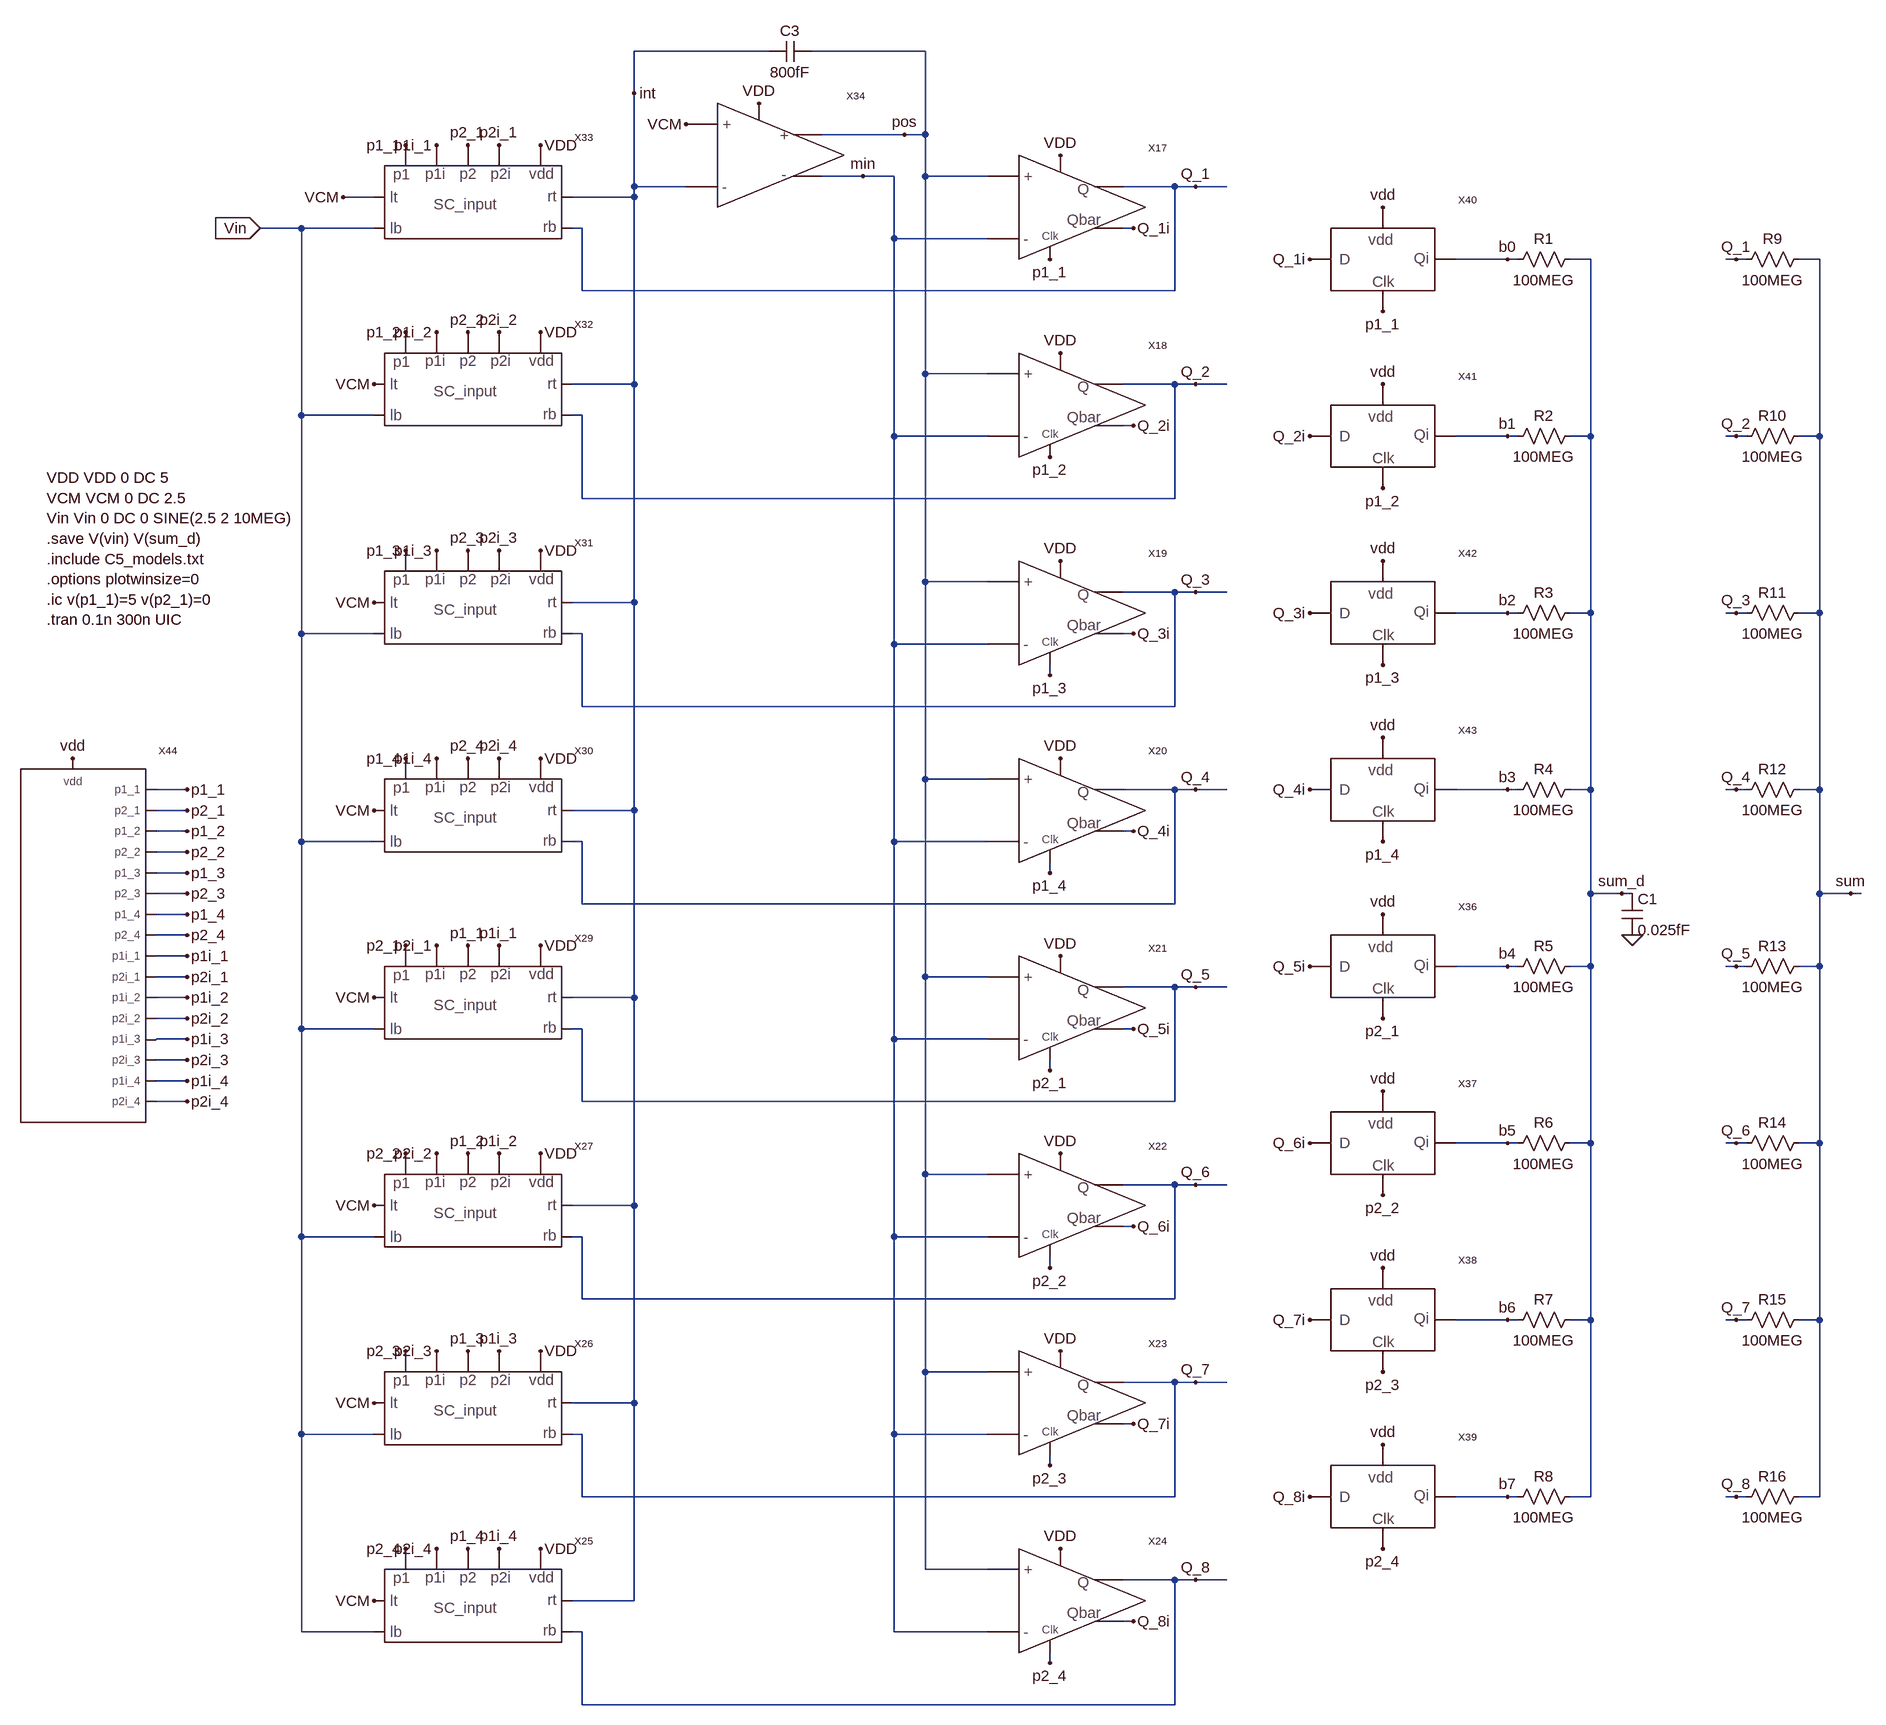
[diagram p0: schematic _Fig9_33_MSD.asc]
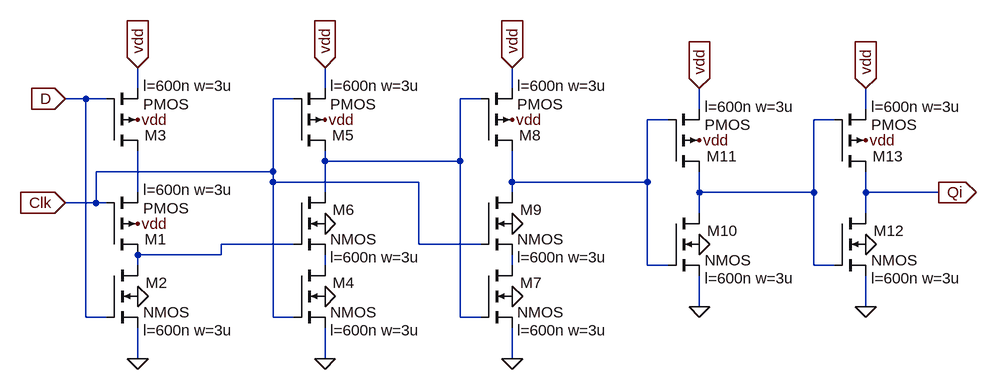
[diagram p1: sub-circuit dflop.asc]
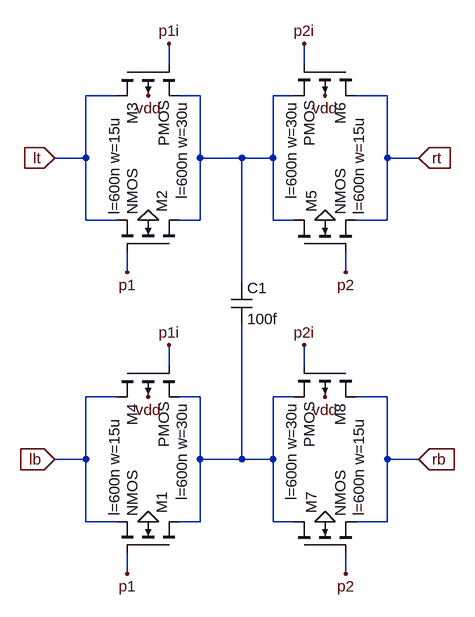
[diagram p2: sub-circuit sc_input.asc]
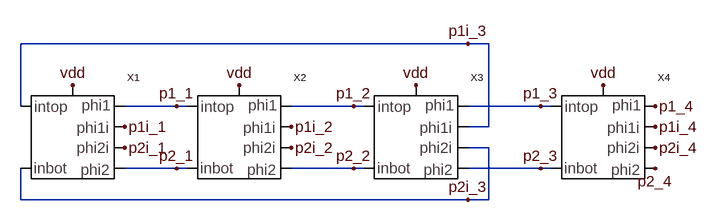
[diagram p3: sub-circuit clock_gen.asc]
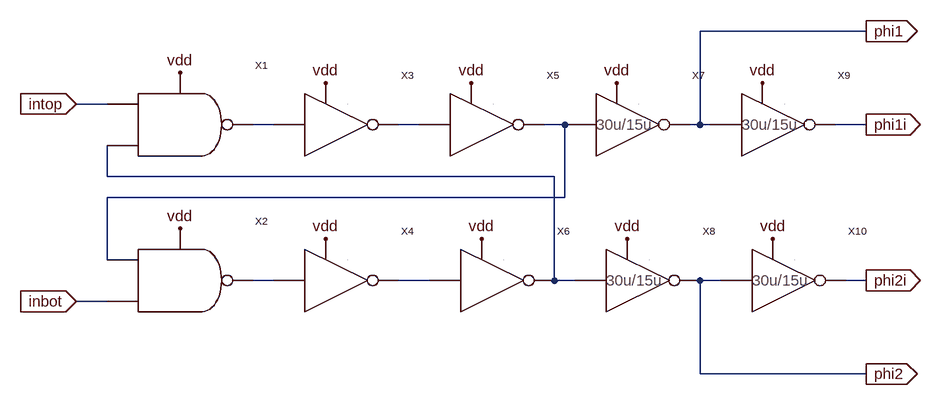
[diagram p4: sub-circuit delay.asc]
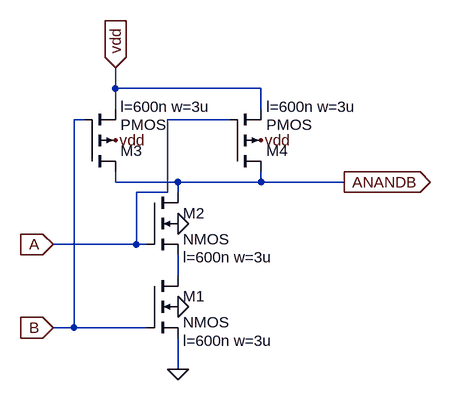
[diagram p5: sub-circuit nand_2.asc]
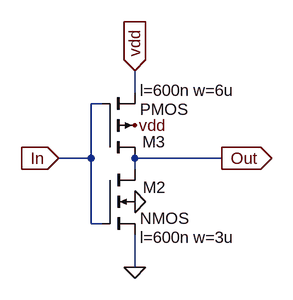
[diagram p6: sub-circuit inv_6u_3u.asc]
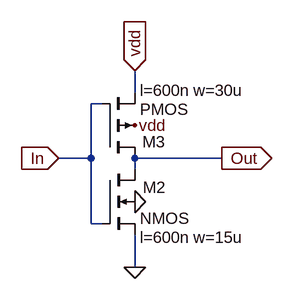
[diagram p7: sub-circuit inv_30u_15u.asc]
_Fig9_33_MSD.asc, the LTspice schematic file:
Version 4
SHEET 1 4792 3092
WIRE 1792 320 1584 320
WIRE 2032 320 1856 320
WIRE 1584 384 1584 320
WIRE 2000 448 1872 448
WIRE 2032 448 2032 320
WIRE 2032 448 2000 448
WIRE 1936 512 1872 512
WIRE 1984 512 1936 512
WIRE 2032 512 2032 448
WIRE 2128 512 2032 512
WIRE 1584 528 1584 384
WIRE 1664 528 1584 528
WIRE 2416 528 2336 528
WIRE 2448 528 2416 528
WIRE 2496 528 2448 528
WIRE 1184 544 1136 544
WIRE 1584 544 1584 528
WIRE 1584 544 1488 544
WIRE 1072 592 1008 592
WIRE 1184 592 1072 592
WIRE 1504 592 1488 592
WIRE 2352 592 2336 592
WIRE 1984 608 1984 512
WIRE 2128 608 1984 608
WIRE 2928 640 2848 640
WIRE 2944 640 2928 640
WIRE 3056 640 3024 640
WIRE 3280 640 3264 640
WIRE 3296 640 3280 640
WIRE 3408 640 3376 640
WIRE 1504 688 1504 592
WIRE 2416 688 2416 528
WIRE 2416 688 1504 688
WIRE 2032 816 2032 512
WIRE 2128 816 2032 816
WIRE 1584 832 1584 544
WIRE 1584 832 1488 832
WIRE 2416 832 2336 832
WIRE 2448 832 2416 832
WIRE 2496 832 2448 832
WIRE 1072 880 1072 592
WIRE 1184 880 1072 880
WIRE 1504 880 1488 880
WIRE 2352 896 2336 896
WIRE 1984 912 1984 608
WIRE 2128 912 1984 912
WIRE 2928 912 2848 912
WIRE 2944 912 2928 912
WIRE 3056 912 3056 640
WIRE 3056 912 3024 912
WIRE 3280 912 3264 912
WIRE 3296 912 3280 912
WIRE 3408 912 3408 640
WIRE 3408 912 3376 912
WIRE 1504 1008 1504 880
WIRE 2416 1008 2416 832
WIRE 2416 1008 1504 1008
WIRE 2032 1136 2032 816
WIRE 2128 1136 2032 1136
WIRE 2416 1152 2336 1152
WIRE 2448 1152 2416 1152
WIRE 2496 1152 2448 1152
WIRE 1584 1168 1584 832
WIRE 1584 1168 1488 1168
WIRE 2928 1184 2848 1184
WIRE 2944 1184 2928 1184
WIRE 3056 1184 3056 912
WIRE 3056 1184 3024 1184
WIRE 3280 1184 3264 1184
WIRE 3296 1184 3280 1184
WIRE 3408 1184 3408 912
WIRE 3408 1184 3376 1184
WIRE 1072 1216 1072 880
WIRE 1184 1216 1072 1216
WIRE 1504 1216 1488 1216
WIRE 2352 1216 2336 1216
WIRE 1984 1232 1984 912
WIRE 2128 1232 1984 1232
WIRE 2224 1280 2224 1264
WIRE 1504 1328 1504 1216
WIRE 2416 1328 2416 1152
WIRE 2416 1328 1504 1328
WIRE 2032 1440 2032 1136
WIRE 2128 1440 2032 1440
WIRE 896 1456 848 1456
WIRE 2416 1456 2336 1456
WIRE 2448 1456 2416 1456
WIRE 2496 1456 2448 1456
WIRE 2928 1456 2848 1456
WIRE 2944 1456 2928 1456
WIRE 3056 1456 3056 1184
WIRE 3056 1456 3024 1456
WIRE 3280 1456 3264 1456
WIRE 3296 1456 3280 1456
WIRE 3408 1456 3408 1184
WIRE 3408 1456 3376 1456
WIRE 896 1488 848 1488
WIRE 1584 1488 1584 1168
WIRE 1584 1488 1488 1488
WIRE 896 1520 848 1520
WIRE 2352 1520 2336 1520
WIRE 1072 1536 1072 1216
WIRE 1184 1536 1072 1536
WIRE 1504 1536 1488 1536
WIRE 1984 1536 1984 1232
WIRE 2128 1536 1984 1536
WIRE 896 1552 848 1552
WIRE 896 1584 848 1584
WIRE 2224 1584 2224 1568
WIRE 896 1616 848 1616
WIRE 3056 1616 3056 1456
WIRE 3104 1616 3056 1616
WIRE 3120 1616 3104 1616
WIRE 3408 1616 3408 1456
WIRE 3456 1616 3408 1616
WIRE 3472 1616 3456 1616
WIRE 1504 1632 1504 1536
WIRE 2416 1632 2416 1456
WIRE 2416 1632 1504 1632
WIRE 896 1648 848 1648
WIRE 896 1680 848 1680
WIRE 896 1712 848 1712
WIRE 2928 1728 2848 1728
WIRE 2944 1728 2928 1728
WIRE 3056 1728 3056 1616
WIRE 3056 1728 3024 1728
WIRE 3280 1728 3264 1728
WIRE 3296 1728 3280 1728
WIRE 3408 1728 3408 1616
WIRE 3408 1728 3376 1728
WIRE 896 1744 848 1744
WIRE 2032 1744 2032 1440
WIRE 2128 1744 2032 1744
WIRE 2416 1760 2336 1760
WIRE 2448 1760 2416 1760
WIRE 2496 1760 2448 1760
WIRE 896 1776 848 1776
WIRE 1584 1776 1584 1488
WIRE 1584 1776 1488 1776
WIRE 896 1808 848 1808
WIRE 1072 1824 1072 1536
WIRE 1184 1824 1072 1824
WIRE 1504 1824 1488 1824
WIRE 2352 1824 2336 1824
WIRE 896 1840 848 1840
WIRE 1984 1840 1984 1536
WIRE 2128 1840 1984 1840
WIRE 896 1872 848 1872
WIRE 2224 1888 2224 1872
WIRE 896 1904 848 1904
WIRE 896 1936 848 1936
WIRE 1504 1936 1504 1824
WIRE 2416 1936 2416 1760
WIRE 2416 1936 1504 1936
WIRE 2928 2000 2848 2000
WIRE 2944 2000 2928 2000
WIRE 3056 2000 3056 1728
WIRE 3056 2000 3024 2000
WIRE 3280 2000 3264 2000
WIRE 3296 2000 3280 2000
WIRE 3408 2000 3408 1728
WIRE 3408 2000 3376 2000
WIRE 2032 2048 2032 1744
WIRE 2128 2048 2032 2048
WIRE 2416 2064 2336 2064
WIRE 2448 2064 2416 2064
WIRE 2496 2064 2448 2064
WIRE 1584 2096 1584 1776
WIRE 1584 2096 1488 2096
WIRE 2352 2128 2336 2128
WIRE 1072 2144 1072 1824
WIRE 1184 2144 1072 2144
WIRE 1504 2144 1488 2144
WIRE 1984 2144 1984 1840
WIRE 2128 2144 1984 2144
WIRE 2224 2192 2224 2176
WIRE 1504 2240 1504 2144
WIRE 2416 2240 2416 2064
WIRE 2416 2240 1504 2240
WIRE 2928 2272 2848 2272
WIRE 2944 2272 2928 2272
WIRE 3056 2272 3056 2000
WIRE 3056 2272 3024 2272
WIRE 3280 2272 3264 2272
WIRE 3296 2272 3280 2272
WIRE 3408 2272 3408 2000
WIRE 3408 2272 3376 2272
WIRE 2032 2352 2032 2048
WIRE 2128 2352 2032 2352
WIRE 2416 2368 2336 2368
WIRE 2448 2368 2416 2368
WIRE 2496 2368 2448 2368
WIRE 1584 2400 1584 2096
WIRE 1584 2400 1488 2400
WIRE 2352 2432 2336 2432
WIRE 1072 2448 1072 2144
WIRE 1184 2448 1072 2448
WIRE 1504 2448 1488 2448
WIRE 1984 2448 1984 2144
WIRE 2128 2448 1984 2448
WIRE 2224 2496 2224 2480
WIRE 1504 2544 1504 2448
WIRE 2416 2544 2416 2368
WIRE 2416 2544 1504 2544
WIRE 2928 2544 2848 2544
WIRE 2944 2544 2928 2544
WIRE 3056 2544 3056 2272
WIRE 3056 2544 3024 2544
WIRE 3280 2544 3264 2544
WIRE 3296 2544 3280 2544
WIRE 3408 2544 3408 2272
WIRE 3408 2544 3376 2544
WIRE 2032 2656 2032 2352
WIRE 2128 2656 2032 2656
WIRE 2416 2672 2336 2672
WIRE 2448 2672 2416 2672
WIRE 2496 2672 2448 2672
WIRE 1584 2704 1584 2400
WIRE 1584 2704 1488 2704
WIRE 2352 2736 2336 2736
WIRE 1072 2752 1072 2448
WIRE 1184 2752 1072 2752
WIRE 1504 2752 1488 2752
WIRE 1984 2752 1984 2448
WIRE 2128 2752 1984 2752
WIRE 2224 2800 2224 2784
WIRE 1504 2864 1504 2752
WIRE 2416 2864 2416 2672
WIRE 2416 2864 1504 2864
FLAG 1440 464 VDD
FLAG 1136 544 VCM
FLAG 2240 480 VDD
FLAG 2448 528 Q_1
FLAG 1440 752 VDD
FLAG 1184 832 VCM
FLAG 2240 784 VDD
FLAG 2448 832 Q_2
FLAG 1440 1088 VDD
FLAG 1184 1168 VCM
FLAG 2240 1104 VDD
FLAG 2448 1152 Q_3
FLAG 1440 1408 VDD
FLAG 1184 1488 VCM
FLAG 2240 1408 VDD
FLAG 1440 1696 VDD
FLAG 1184 1776 VCM
FLAG 2240 1712 VDD
FLAG 2448 1760 Q_5
FLAG 1440 2016 VDD
FLAG 1184 2096 VCM
FLAG 2240 2016 VDD
FLAG 2448 2064 Q_6
FLAG 1440 2320 VDD
FLAG 1184 2400 VCM
FLAG 2240 2320 VDD
FLAG 2448 2368 Q_7
FLAG 1440 2624 VDD
FLAG 1184 2704 VCM
FLAG 2240 2624 VDD
FLAG 2448 2672 Q_8
FLAG 2448 1456 Q_4
FLAG 1664 432 VCM
FLAG 2000 448 pos
FLAG 1584 384 int
FLAG 2224 640 p1_1
FLAG 2224 944 p1_2
FLAG 2224 1280 p1_3
FLAG 2224 1584 p1_4
FLAG 2224 1888 p2_1
FLAG 2224 2192 p2_2
FLAG 2224 2496 p2_3
FLAG 2224 2800 p2_4
FLAG 1232 464 p1_1
FLAG 1328 464 p2_1
FLAG 1232 752 p1_2
FLAG 1328 752 p2_2
FLAG 1232 1088 p1_3
FLAG 1328 1088 p2_3
FLAG 1232 1408 p1_4
FLAG 1328 1408 p2_4
FLAG 1232 1696 p2_1
FLAG 1328 1696 p1_1
FLAG 1232 2016 p2_2
FLAG 1328 2016 p1_2
FLAG 1232 2320 p2_3
FLAG 1328 2320 p1_3
FLAG 1232 2624 p2_4
FLAG 1328 2624 p1_4
FLAG 2928 640 b0
FLAG 2928 912 b1
FLAG 2928 1184 b2
FLAG 2928 1456 b3
FLAG 2928 1728 b4
FLAG 2928 2000 b5
FLAG 2928 2272 b6
FLAG 2928 2544 b7
FLAG 2624 1728 Q_5i
FLAG 2624 2000 Q_6i
FLAG 2624 2272 Q_7i
FLAG 2624 2544 Q_8i
FLAG 2624 640 Q_1i
FLAG 2624 912 Q_2i
FLAG 2624 1184 Q_3i
FLAG 2624 1456 Q_4i
FLAG 2736 1648 vdd
FLAG 2736 1920 vdd
FLAG 2736 2192 vdd
FLAG 2736 2464 vdd
FLAG 2736 560 vdd
FLAG 2736 832 vdd
FLAG 2736 1104 vdd
FLAG 2736 1376 vdd
FLAG 2736 2624 p2_4
FLAG 2736 2352 p2_3
FLAG 2736 2080 p2_2
FLAG 2736 1808 p2_1
FLAG 2736 1536 p1_4
FLAG 2736 1264 p1_3
FLAG 2736 992 p1_2
FLAG 2736 720 p1_1
FLAG 720 1408 vdd
FLAG 896 1456 p1_1
FLAG 896 1488 p2_1
FLAG 896 1520 p1_2
FLAG 896 1552 p2_2
FLAG 896 1584 p1_3
FLAG 896 1616 p2_3
FLAG 896 1648 p1_4
FLAG 896 1680 p2_4
FLAG 896 1712 p1i_1
FLAG 896 1744 p2i_1
FLAG 896 1776 p1i_2
FLAG 896 1808 p2i_2
FLAG 896 1840 p1i_3
FLAG 896 1872 p2i_3
FLAG 896 1904 p1i_4
FLAG 896 1936 p2i_4
FLAG 1936 512 min
FLAG 2352 592 Q_1i
FLAG 2352 896 Q_2i
FLAG 2352 1216 Q_3i
FLAG 1776 400 VDD
FLAG 1280 464 p1i_1
FLAG 1376 464 p2i_1
FLAG 1280 752 p1i_2
FLAG 1376 752 p2i_2
FLAG 1280 1088 p1i_3
FLAG 1376 1088 p2i_3
FLAG 1280 1408 p1i_4
FLAG 1376 1408 p2i_4
FLAG 1280 1696 p2i_1
FLAG 1376 1696 p1i_1
FLAG 1280 2016 p2i_2
FLAG 1376 2016 p1i_2
FLAG 1280 2320 p2i_3
FLAG 1376 2320 p1i_3
FLAG 1280 2624 p2i_4
FLAG 1376 2624 p1i_4
FLAG 2352 1520 Q_4i
FLAG 2352 1824 Q_5i
FLAG 2352 2128 Q_6i
FLAG 2352 2432 Q_7i
FLAG 2352 2736 Q_8i
FLAG 1008 592 Vin
IOPIN 1008 592 In
FLAG 3120 1680 0
FLAG 3104 1616 sum_d
FLAG 3280 640 Q_1
FLAG 3280 912 Q_2
FLAG 3280 1184 Q_3
FLAG 3280 1456 Q_4
FLAG 3280 1728 Q_5
FLAG 3280 2000 Q_6
FLAG 3280 2272 Q_7
FLAG 3280 2544 Q_8
FLAG 3456 1616 sum
SYMBOL cap 1792 336 R270
WINDOW 0 32 32 VTop 2
WINDOW 3 0 32 VBottom 2
SYMATTR InstName C3
SYMATTR Value 800fF
SYMBOL dflop 2656 1776 R0
SYMATTR InstName X36
SYMBOL dflop 2656 2048 R0
SYMATTR InstName X37
SYMBOL dflop 2656 2320 R0
SYMATTR InstName X38
SYMBOL dflop 2656 2592 R0
SYMATTR InstName X39
SYMBOL dflop 2656 688 R0
SYMATTR InstName X40
SYMBOL dflop 2656 960 R0
SYMATTR InstName X41
SYMBOL dflop 2656 1232 R0
SYMATTR InstName X42
SYMBOL dflop 2656 1504 R0
SYMATTR InstName X43
SYMBOL SC_input 1248 2784 R0
SYMATTR InstName X25
SYMBOL SC_input 1248 2480 R0
SYMATTR InstName X26
SYMBOL SC_input 1248 2176 R0
SYMATTR InstName X27
SYMBOL SC_input 1248 1856 R0
SYMATTR InstName X29
SYMBOL SC_input 1248 1568 R0
SYMATTR InstName X30
SYMBOL SC_input 1248 1248 R0
SYMATTR InstName X31
SYMBOL SC_input 1248 912 R0
SYMATTR InstName X32
SYMBOL SC_input 1248 624 R0
SYMATTR InstName X33
SYMBOL clock_gen 768 1584 R0
SYMATTR InstName X44
SYMBOL clk_comparator 2176 560 R0
SYMATTR InstName X17
SYMBOL clk_comparator 2176 864 R0
SYMATTR InstName X18
SYMBOL clk_comparator 2176 1184 R0
SYMATTR InstName X19
SYMBOL clk_comparator 2176 1488 R0
SYMATTR InstName X20
SYMBOL clk_comparator 2176 1792 R0
SYMATTR InstName X21
SYMBOL clk_comparator 2176 2096 R0
SYMATTR InstName X22
SYMBOL clk_comparator 2176 2400 R0
SYMATTR InstName X23
SYMBOL clk_comparator 2176 2704 R0
SYMATTR InstName X24
SYMBOL amp 1712 480 R0
SYMATTR InstName X34
SYMBOL res 3040 624 R90
WINDOW 0 0 56 VBottom 2
WINDOW 3 32 56 VTop 2
SYMATTR InstName R1
SYMATTR Value 100MEG
SYMBOL res 3040 896 R90
WINDOW 0 0 56 VBottom 2
WINDOW 3 32 56 VTop 2
SYMATTR InstName R2
SYMATTR Value 100MEG
SYMBOL res 3040 1168 R90
WINDOW 0 0 56 VBottom 2
WINDOW 3 32 56 VTop 2
SYMATTR InstName R3
SYMATTR Value 100MEG
SYMBOL res 3040 1440 R90
WINDOW 0 0 56 VBottom 2
WINDOW 3 32 56 VTop 2
SYMATTR InstName R4
SYMATTR Value 100MEG
SYMBOL res 3040 1712 R90
WINDOW 0 0 56 VBottom 2
WINDOW 3 32 56 VTop 2
SYMATTR InstName R5
SYMATTR Value 100MEG
SYMBOL res 3040 1984 R90
WINDOW 0 0 56 VBottom 2
WINDOW 3 32 56 VTop 2
SYMATTR InstName R6
SYMATTR Value 100MEG
SYMBOL res 3040 2256 R90
WINDOW 0 0 56 VBottom 2
WINDOW 3 32 56 VTop 2
SYMATTR InstName R7
SYMATTR Value 100MEG
SYMBOL res 3040 2528 R90
WINDOW 0 0 56 VBottom 2
WINDOW 3 32 56 VTop 2
SYMATTR InstName R8
SYMATTR Value 100MEG
SYMBOL cap 3104 1616 R0
SYMATTR InstName C1
SYMATTR Value 0.025fF
SYMBOL res 3392 624 R90
WINDOW 0 0 56 VBottom 2
WINDOW 3 32 56 VTop 2
SYMATTR InstName R9
SYMATTR Value 100MEG
SYMBOL res 3392 896 R90
WINDOW 0 0 56 VBottom 2
WINDOW 3 32 56 VTop 2
SYMATTR InstName R10
SYMATTR Value 100MEG
SYMBOL res 3392 1168 R90
WINDOW 0 0 56 VBottom 2
WINDOW 3 32 56 VTop 2
SYMATTR InstName R11
SYMATTR Value 100MEG
SYMBOL res 3392 1440 R90
WINDOW 0 0 56 VBottom 2
WINDOW 3 32 56 VTop 2
SYMATTR InstName R12
SYMATTR Value 100MEG
SYMBOL res 3392 1712 R90
WINDOW 0 0 56 VBottom 2
WINDOW 3 32 56 VTop 2
SYMATTR InstName R13
SYMATTR Value 100MEG
SYMBOL res 3392 1984 R90
WINDOW 0 0 56 VBottom 2
WINDOW 3 32 56 VTop 2
SYMATTR InstName R14
SYMATTR Value 100MEG
SYMBOL res 3392 2256 R90
WINDOW 0 0 56 VBottom 2
WINDOW 3 32 56 VTop 2
SYMATTR InstName R15
SYMATTR Value 100MEG
SYMBOL res 3392 2528 R90
WINDOW 0 0 56 VBottom 2
WINDOW 3 32 56 VTop 2
SYMATTR InstName R16
SYMATTR Value 100MEG
TEXT 680 976 Left 2 !VDD VDD 0 DC 5\nVCM VCM 0 DC 2.5\nVin Vin 0 DC 0 SINE(2.5 2 10MEG)\n.save V(vin) V(sum_d)\n.include C5_models.txt\n.options plotwinsize=0\n.ic v(p1_1)=5 v(p2_1)=0\n.tran 0.1n 300n UIC

dflop.asc, the sub-circuit schematic file:
Version 4
SHEET 1 1692 680
WIRE 272 -208 272 -240
WIRE 560 -208 560 -240
WIRE 848 -208 848 -240
WIRE 192 -192 160 -192
WIRE 224 -192 192 -192
WIRE 512 -192 480 -192
WIRE 800 -192 768 -192
WIRE 1136 -176 1136 -208
WIRE 1392 -176 1392 -208
WIRE 1088 -160 1056 -160
WIRE 1344 -160 1312 -160
WIRE 560 -96 560 -112
WIRE 768 -96 768 -192
WIRE 768 -96 560 -96
WIRE 480 -80 480 -192
WIRE 480 -80 208 -80
WIRE 480 -64 480 -80
WIRE 704 -64 480 -64
WIRE 848 -64 848 -112
WIRE 1056 -64 1056 -160
WIRE 1056 -64 848 -64
WIRE 272 -48 272 -112
WIRE 560 -48 560 -96
WIRE 848 -48 848 -64
WIRE 1136 -48 1136 -80
WIRE 1312 -48 1312 -160
WIRE 1312 -48 1136 -48
WIRE 1392 -48 1392 -80
WIRE 1504 -48 1392 -48
WIRE 208 -32 208 -80
WIRE 208 -32 160 -32
WIRE 224 -32 208 -32
WIRE 1136 -16 1136 -48
WIRE 1392 -16 1392 -48
WIRE 512 32 400 32
WIRE 704 32 704 -64
WIRE 800 32 704 32
WIRE 400 48 400 32
WIRE 400 48 272 48
WIRE 272 64 272 48
WIRE 560 64 560 48
WIRE 848 64 848 48
WIRE 1056 64 1056 -64
WIRE 1088 64 1056 64
WIRE 1312 64 1312 -48
WIRE 1344 64 1312 64
WIRE 1136 128 1136 80
WIRE 1392 128 1392 80
WIRE 192 144 192 -192
WIRE 224 144 192 144
WIRE 480 144 480 -64
WIRE 512 144 480 144
WIRE 768 144 768 -96
WIRE 800 144 768 144
WIRE 272 208 272 160
WIRE 560 208 560 160
WIRE 848 208 848 160
FLAG 272 208 0
FLAG 272 112 0
FLAG 160 -192 D
IOPIN 160 -192 In
FLAG 272 -240 vdd
IOPIN 272 -240 In
FLAG 272 -160 vdd
FLAG 1504 -48 Qi
IOPIN 1504 -48 Out
FLAG 160 -32 Clk
IOPIN 160 -32 In
FLAG 272 0 vdd
FLAG 560 208 0
FLAG 560 112 0
FLAG 560 -240 vdd
IOPIN 560 -240 In
FLAG 560 -160 vdd
FLAG 560 0 0
FLAG 848 208 0
FLAG 848 112 0
FLAG 848 -240 vdd
IOPIN 848 -240 In
FLAG 848 -160 vdd
FLAG 848 0 0
FLAG 1136 128 0
FLAG 1136 32 0
FLAG 1136 -208 vdd
IOPIN 1136 -208 In
FLAG 1136 -128 vdd
FLAG 1392 128 0
FLAG 1392 32 0
FLAG 1392 -208 vdd
IOPIN 1392 -208 In
FLAG 1392 -128 vdd
SYMBOL nmos4 224 64 R0
WINDOW 123 56 100 Left 2
WINDOW 0 60 27 Left 2
SYMATTR Value2 l=600n w=3u
SYMATTR InstName M2
SYMBOL pmos4 224 -112 M180
WINDOW 123 56 100 Left 2
WINDOW 0 59 24 Left 2
SYMATTR Value2 l=600n w=3u
SYMATTR InstName M3
SYMBOL pmos4 224 48 M180
WINDOW 123 56 100 Left 2
WINDOW 0 59 24 Left 2
SYMATTR Value2 l=600n w=3u
SYMATTR InstName M1
SYMBOL nmos4 512 64 R0
WINDOW 123 56 100 Left 2
WINDOW 0 60 27 Left 2
SYMATTR Value2 l=600n w=3u
SYMATTR InstName M4
SYMBOL pmos4 512 -112 M180
WINDOW 123 56 100 Left 2
WINDOW 0 59 24 Left 2
SYMATTR Value2 l=600n w=3u
SYMATTR InstName M5
SYMBOL nmos4 512 -48 R0
WINDOW 123 56 100 Left 2
WINDOW 0 60 27 Left 2
SYMATTR Value2 l=600n w=3u
SYMATTR InstName M6
SYMBOL nmos4 800 64 R0
WINDOW 123 56 100 Left 2
WINDOW 0 60 27 Left 2
SYMATTR Value2 l=600n w=3u
SYMATTR InstName M7
SYMBOL pmos4 800 -112 M180
WINDOW 123 56 100 Left 2
WINDOW 0 59 24 Left 2
SYMATTR Value2 l=600n w=3u
SYMATTR InstName M8
SYMBOL nmos4 800 -48 R0
WINDOW 123 56 100 Left 2
WINDOW 0 60 27 Left 2
SYMATTR Value2 l=600n w=3u
SYMATTR InstName M9
SYMBOL nmos4 1088 -16 R0
WINDOW 123 56 100 Left 2
WINDOW 0 60 27 Left 2
SYMATTR Value2 l=600n w=3u
SYMATTR InstName M10
SYMBOL pmos4 1088 -80 M180
WINDOW 123 56 100 Left 2
WINDOW 0 59 24 Left 2
SYMATTR Value2 l=600n w=3u
SYMATTR InstName M11
SYMBOL nmos4 1344 -16 R0
WINDOW 123 56 100 Left 2
WINDOW 0 60 27 Left 2
SYMATTR Value2 l=600n w=3u
SYMATTR InstName M12
SYMBOL pmos4 1344 -80 M180
WINDOW 123 56 100 Left 2
WINDOW 0 59 24 Left 2
SYMATTR Value2 l=600n w=3u
SYMATTR InstName M13

sc_input.asc, the sub-circuit schematic file:
Version 4
SHEET 1 880 716
WIRE 320 -144 320 -176
WIRE 528 -144 528 -176
WIRE 240 -96 192 -96
WIRE 368 -96 336 -96
WIRE 512 -96 480 -96
WIRE 656 -96 608 -96
WIRE 192 0 192 -96
WIRE 192 0 144 0
WIRE 368 0 368 -96
WIRE 432 0 368 0
WIRE 480 0 480 -96
WIRE 480 0 432 0
WIRE 656 0 656 -96
WIRE 704 0 656 0
WIRE 192 96 192 0
WIRE 240 96 192 96
WIRE 368 96 368 0
WIRE 368 96 336 96
WIRE 480 96 480 0
WIRE 512 96 480 96
WIRE 656 96 656 0
WIRE 656 96 608 96
WIRE 256 176 256 144
WIRE 592 176 592 144
WIRE 432 192 432 0
WIRE 320 320 320 288
WIRE 528 320 528 288
WIRE 240 368 192 368
WIRE 368 368 336 368
WIRE 512 368 480 368
WIRE 656 368 608 368
WIRE 192 464 192 368
WIRE 192 464 144 464
WIRE 368 464 368 368
WIRE 432 464 432 256
WIRE 432 464 368 464
WIRE 480 464 480 368
WIRE 480 464 432 464
WIRE 656 464 656 368
WIRE 704 464 656 464
WIRE 192 560 192 464
WIRE 240 560 192 560
WIRE 368 560 368 464
WIRE 368 560 336 560
WIRE 480 560 480 464
WIRE 512 560 480 560
WIRE 656 560 656 464
WIRE 656 560 608 560
WIRE 256 640 256 608
WIRE 592 640 592 608
FLAG 288 96 0
FLAG 288 -96 vdd
FLAG 144 0 lt
IOPIN 144 0 In
FLAG 320 -176 p1i
FLAG 256 176 p1
FLAG 288 560 0
FLAG 288 368 vdd
FLAG 144 464 lb
IOPIN 144 464 In
FLAG 320 288 p1i
FLAG 256 640 p1
FLAG 560 96 0
FLAG 560 -96 vdd
FLAG 704 0 rt
IOPIN 704 0 In
FLAG 528 -176 p2i
FLAG 592 176 p2
FLAG 560 560 0
FLAG 560 368 vdd
FLAG 704 464 rb
IOPIN 704 464 In
FLAG 528 288 p2i
FLAG 592 640 p2
SYMBOL nmos4 336 144 M270
WINDOW 123 56 100 Left 2
WINDOW 0 60 27 Left 2
SYMATTR Value2 l=600n w=15u
SYMATTR InstName M2
SYMBOL pmos4 240 -144 M90
WINDOW 123 56 100 Left 2
WINDOW 0 59 24 Left 2
SYMATTR Value2 l=600n w=30u
SYMATTR InstName M3
SYMBOL nmos4 336 608 M270
WINDOW 123 56 100 Left 2
WINDOW 0 60 27 Left 2
SYMATTR Value2 l=600n w=15u
SYMATTR InstName M1
SYMBOL pmos4 240 320 M90
WINDOW 123 56 100 Left 2
WINDOW 0 59 24 Left 2
SYMATTR Value2 l=600n w=30u
SYMATTR InstName M4
SYMBOL nmos4 512 144 R270
WINDOW 123 56 100 Left 2
WINDOW 0 60 27 Left 2
SYMATTR Value2 l=600n w=15u
SYMATTR InstName M5
SYMBOL pmos4 608 -144 R90
WINDOW 123 56 100 Left 2
WINDOW 0 59 24 Left 2
SYMATTR Value2 l=600n w=30u
SYMATTR InstName M6
SYMBOL nmos4 512 608 R270
WINDOW 123 56 100 Left 2
WINDOW 0 60 27 Left 2
SYMATTR Value2 l=600n w=15u
SYMATTR InstName M7
SYMBOL pmos4 608 320 R90
WINDOW 123 56 100 Left 2
WINDOW 0 59 24 Left 2
SYMATTR Value2 l=600n w=30u
SYMATTR InstName M8
SYMBOL cap 416 192 R0
SYMATTR InstName C1
SYMATTR Value 100f

clock_gen.asc, the sub-circuit schematic file:
Version 4
SHEET 1 1048 680
WIRE 672 32 -16 32
WIRE 704 32 672 32
WIRE 704 160 704 32
WIRE -16 128 -16 32
WIRE 224 128 144 128
WIRE 240 128 224 128
WIRE 496 128 400 128
WIRE 512 128 496 128
WIRE 784 128 672 128
WIRE 800 128 784 128
WIRE 704 160 672 160
WIRE 704 192 672 192
WIRE 224 224 144 224
WIRE 240 224 224 224
WIRE 496 224 400 224
WIRE 512 224 496 224
WIRE 784 224 672 224
WIRE 800 224 784 224
WIRE -16 272 -16 224
WIRE 672 272 -16 272
WIRE 704 272 704 192
WIRE 704 272 672 272
FLAG 64 96 vdd
FLAG 320 96 vdd
FLAG 592 96 vdd
FLAG 880 96 vdd
FLAG 224 128 p1_1
FLAG 496 128 p1_2
FLAG 784 128 p1_3
FLAG 960 128 p1_4
FLAG 144 160 p1i_1
FLAG 400 160 p1i_2
FLAG 672 32 p1i_3
FLAG 960 160 p1i_4
FLAG 144 192 p2i_1
FLAG 400 192 p2i_2
FLAG 672 272 p2i_3
FLAG 960 192 p2i_4
FLAG 224 224 p2_1
FLAG 496 224 p2_2
FLAG 784 224 p2_3
FLAG 960 224 p2_4
SYMBOL delay 64 176 R0
SYMATTR InstName X1
SYMBOL delay 320 176 R0
SYMATTR InstName X2
SYMBOL delay 592 176 R0
SYMATTR InstName X3
SYMBOL delay 880 176 R0
SYMATTR InstName X4

delay.asc, the sub-circuit schematic file:
Version 4
SHEET 1 1340 680
WIRE 1216 -16 960 -16
WIRE 48 96 0 96
WIRE 304 128 272 128
WIRE 528 128 496 128
WIRE 752 128 720 128
WIRE 960 128 960 -16
WIRE 960 128 944 128
WIRE 976 128 960 128
WIRE 1216 128 1168 128
WIRE 48 208 48 160
WIRE 736 208 48 208
WIRE 752 240 752 128
WIRE 752 240 48 240
WIRE 48 336 48 240
WIRE 304 368 272 368
WIRE 544 368 496 368
WIRE 736 368 736 208
WIRE 768 368 736 368
WIRE 992 368 960 368
WIRE 1216 368 1184 368
WIRE 48 400 0 400
WIRE 960 512 960 368
WIRE 1216 512 960 512
FLAG 384 64 vdd
FLAG 160 48 vdd
FLAG 608 64 vdd
FLAG 624 304 vdd
FLAG 384 304 vdd
FLAG 160 288 vdd
FLAG 832 64 vdd
FLAG 1056 64 vdd
FLAG 848 304 vdd
FLAG 1072 304 vdd
FLAG 1216 -16 phi1
IOPIN 1216 -16 Out
FLAG 1216 128 phi1i
IOPIN 1216 128 Out
FLAG 1216 368 phi2i
IOPIN 1216 368 Out
FLAG 1216 512 phi2
IOPIN 1216 512 Out
FLAG 0 96 intop
IOPIN 0 96 In
FLAG 0 400 inbot
IOPIN 0 400 In
SYMBOL NAND_2 80 128 R0
SYMATTR InstName X1
SYMBOL NAND_2 80 368 R0
SYMATTR InstName X2
SYMBOL Inv_6u_3u 304 128 R0
SYMATTR InstName X3
SYMBOL Inv_6u_3u 304 368 R0
SYMATTR InstName X4
SYMBOL Inv_6u_3u 528 128 R0
SYMATTR InstName X5
SYMBOL Inv_6u_3u 544 368 R0
SYMATTR InstName X6
SYMBOL Inv_30u_15u 752 128 R0
SYMATTR InstName X7
SYMBOL Inv_30u_15u 768 368 R0
SYMATTR InstName X8
SYMBOL Inv_30u_15u 976 128 R0
SYMATTR InstName X9
SYMBOL Inv_30u_15u 992 368 R0
SYMATTR InstName X10

nand_2.asc, the sub-circuit schematic file:
Version 4
SHEET 1 880 680
WIRE 176 -96 176 -128
WIRE 400 -96 176 -96
WIRE 176 -64 176 -96
WIRE 400 -64 400 -96
WIRE 128 -48 112 -48
WIRE 352 -48 256 -48
WIRE 176 48 176 32
WIRE 272 48 176 48
WIRE 400 48 400 32
WIRE 400 48 272 48
WIRE 528 48 400 48
WIRE 256 64 256 -48
WIRE 256 64 208 64
WIRE 272 64 272 48
WIRE 208 144 208 64
WIRE 208 144 80 144
WIRE 224 144 208 144
WIRE 272 192 272 160
WIRE 112 272 112 -48
WIRE 112 272 80 272
WIRE 224 272 112 272
WIRE 272 336 272 288
FLAG 272 336 0
FLAG 272 240 0
FLAG 272 112 0
FLAG 80 144 A
IOPIN 80 144 In
FLAG 80 272 B
IOPIN 80 272 In
FLAG 176 -128 vdd
IOPIN 176 -128 In
FLAG 176 -16 vdd
FLAG 400 -16 vdd
FLAG 528 48 ANANDB
IOPIN 528 48 Out
SYMBOL nmos4 224 192 R0
WINDOW 123 56 100 Left 2
SYMATTR InstName M1
SYMATTR Value2 l=600n w=3u
SYMBOL nmos4 224 64 R0
WINDOW 123 56 100 Left 2
SYMATTR InstName M2
SYMATTR Value2 l=600n w=3u
SYMBOL pmos4 128 32 M180
WINDOW 123 56 100 Left 2
SYMATTR InstName M3
SYMATTR Value2 l=600n w=3u
SYMBOL pmos4 352 32 M180
WINDOW 123 56 100 Left 2
SYMATTR InstName M4
SYMATTR Value2 l=600n w=3u

inv_6u_3u.asc, the sub-circuit schematic file:
Version 4
SHEET 1 880 680
WIRE 272 -48 272 -80
WIRE 224 -32 208 -32
WIRE 208 48 208 -32
WIRE 208 48 160 48
WIRE 400 48 272 48
WIRE 272 64 272 48
WIRE 208 144 208 48
WIRE 224 144 208 144
WIRE 272 208 272 160
FLAG 272 208 0
FLAG 272 112 0
FLAG 160 48 In
IOPIN 160 48 In
FLAG 272 -80 vdd
IOPIN 272 -80 In
FLAG 272 0 vdd
FLAG 400 48 Out
IOPIN 400 48 Out
SYMBOL nmos4 224 64 R0
WINDOW 123 56 100 Left 2
WINDOW 0 60 27 Left 2
SYMATTR Value2 l=600n w=3u
SYMATTR InstName M2
SYMBOL pmos4 224 48 M180
WINDOW 123 56 100 Left 2
WINDOW 0 59 24 Left 2
SYMATTR Value2 l=600n w=6u
SYMATTR InstName M3

inv_30u_15u.asc, the sub-circuit schematic file:
Version 4
SHEET 1 880 680
WIRE 272 -48 272 -80
WIRE 224 -32 208 -32
WIRE 208 48 208 -32
WIRE 208 48 160 48
WIRE 400 48 272 48
WIRE 272 64 272 48
WIRE 208 144 208 48
WIRE 224 144 208 144
WIRE 272 208 272 160
FLAG 272 208 0
FLAG 272 112 0
FLAG 160 48 In
IOPIN 160 48 In
FLAG 272 -80 vdd
IOPIN 272 -80 In
FLAG 272 0 vdd
FLAG 400 48 Out
IOPIN 400 48 Out
SYMBOL nmos4 224 64 R0
WINDOW 123 56 100 Left 2
WINDOW 0 60 27 Left 2
SYMATTR Value2 l=600n w=15u
SYMATTR InstName M2
SYMBOL pmos4 224 48 M180
WINDOW 123 56 100 Left 2
WINDOW 0 59 24 Left 2
SYMATTR Value2 l=600n w=30u
SYMATTR InstName M3

clk_comparator.asc, the sub-circuit schematic file:
Version 4
SHEET 1 2480 680
WIRE 592 -416 592 -448
WIRE 896 -416 896 -448
WIRE 1200 -416 1200 -448
WIRE 1488 -416 1488 -448
WIRE 544 -400 528 -400
WIRE 960 -400 944 -400
WIRE 1152 -400 1136 -400
WIRE 1584 -400 1536 -400
WIRE 592 -272 592 -320
WIRE 896 -272 896 -320
WIRE 896 -272 592 -272
WIRE 960 -272 1136 -400
WIRE 960 -272 896 -272
WIRE 1136 -272 960 -400
WIRE 1200 -272 1200 -320
WIRE 1200 -272 1136 -272
WIRE 1488 -272 1488 -320
WIRE 1488 -272 1200 -272
WIRE 1696 -272 1488 -272
WIRE 896 -256 896 -272
WIRE 960 -256 896 -256
WIRE 1200 -256 1200 -272
WIRE 1200 -256 1136 -256
WIRE 896 -240 896 -256
WIRE 1200 -240 1200 -256
WIRE 1968 -240 1920 -240
WIRE 2208 -240 2160 -240
WIRE 80 -192 80 -224
WIRE 368 -192 368 -224
WIRE 32 -176 16 -176
WIRE 320 -176 304 -176
WIRE 1920 -176 1920 -240
WIRE 1696 -160 1696 -208
WIRE 1920 -144 1696 -160
WIRE 1696 -128 1920 -176
WIRE 16 -96 16 -176
WIRE 16 -96 -32 -96
WIRE 304 -96 304 -176
WIRE 304 -96 80 -96
WIRE 528 -96 528 -400
WIRE 528 -96 368 -96
WIRE 848 -96 848 -160
WIRE 848 -96 528 -96
WIRE 1152 -96 1152 -160
WIRE 1152 -96 848 -96
WIRE 1584 -96 1584 -400
WIRE 1584 -96 1152 -96
WIRE 80 -80 80 -96
WIRE 368 -80 368 -96
WIRE 1696 -48 1696 -128
WIRE 1920 -16 1920 -144
WIRE 1968 -16 1920 -16
WIRE 2192 -16 2160 -16
WIRE 16 0 16 -96
WIRE 32 0 16 0
WIRE 304 0 304 -96
WIRE 320 0 304 0
WIRE 592 16 592 -272
WIRE 1696 16 592 16
WIRE 80 64 80 16
WIRE 368 64 368 16
WIRE 896 96 896 -144
WIRE 1200 96 1200 -144
WIRE 960 176 1136 -256
WIRE 960 176 944 176
WIRE 1136 176 960 -256
WIRE 1152 176 1136 176
WIRE 896 240 896 192
WIRE 1200 240 1200 192
WIRE 848 320 800 320
WIRE 1296 320 1248 320
WIRE 896 368 896 336
WIRE 1200 368 1200 336
FLAG 80 64 0
FLAG 80 -32 0
FLAG -32 -96 CLK
IOPIN -32 -96 In
FLAG 80 -224 vdd
IOPIN 80 -224 In
FLAG 80 -144 vdd
FLAG 368 64 0
FLAG 368 -32 0
FLAG 368 -224 vdd
FLAG 368 -144 vdd
FLAG 592 -448 vdd
FLAG 592 -368 vdd
FLAG 1200 -448 vdd
FLAG 1200 -368 vdd
FLAG 1488 -448 vdd
FLAG 1488 -368 vdd
FLAG 896 -448 vdd
FLAG 896 -368 vdd
FLAG 896 288 0
FLAG 1200 -192 0
FLAG 896 -192 0
FLAG 1200 144 0
FLAG 896 368 0
FLAG 800 320 InP
FLAG 1200 288 0
FLAG 1200 368 0
FLAG 1296 320 Inm
FLAG 896 144 0
FLAG 1808 -320 vdd
FLAG 1808 -96 vdd
FLAG 2048 -304 vdd
FLAG 2048 -80 vdd
FLAG 2272 -80 vdd
FLAG 2288 -304 vdd
FLAG 2400 -240 Qbar
FLAG 2384 -16 Q
SYMBOL nmos4 32 -80 R0
WINDOW 123 56 100 Left 2
WINDOW 0 60 27 Left 2
SYMATTR Value2 l=600n w=3u
SYMATTR InstName M1
SYMBOL pmos4 32 -96 M180
WINDOW 123 56 100 Left 2
WINDOW 0 59 24 Left 2
SYMATTR Value2 l=600n w=3u
SYMATTR InstName M2
SYMBOL nmos4 320 -80 R0
WINDOW 123 56 100 Left 2
WINDOW 0 60 27 Left 2
SYMATTR Value2 l=600n w=3u
SYMATTR InstName M3
SYMBOL pmos4 320 -96 M180
WINDOW 123 56 100 Left 2
WINDOW 0 59 24 Left 2
SYMATTR Value2 l=600n w=3u
SYMATTR InstName M4
SYMBOL pmos4 544 -320 M180
WINDOW 123 56 100 Left 2
WINDOW 0 59 24 Left 2
SYMATTR Value2 l=600n w=3u
SYMATTR InstName M5
SYMBOL pmos4 1152 -320 M180
WINDOW 123 56 100 Left 2
WINDOW 0 59 24 Left 2
SYMATTR Value2 l=600n w=3u
SYMATTR InstName M6
SYMBOL pmos4 1536 -320 R180
WINDOW 123 56 100 Left 2
WINDOW 0 59 24 Left 2
SYMATTR Value2 l=600n w=3u
SYMATTR InstName M7
SYMBOL pmos4 944 -320 R180
WINDOW 123 56 100 Left 2
WINDOW 0 59 24 Left 2
SYMATTR Value2 l=600n w=3u
SYMATTR InstName M8
SYMBOL nmos4 848 240 R0
WINDOW 123 56 100 Left 2
WINDOW 0 60 27 Left 2
SYMATTR Value2 l=600n w=3u
SYMATTR InstName M9
SYMBOL nmos4 1152 -240 R0
WINDOW 123 56 100 Left 2
WINDOW 0 60 27 Left 2
SYMATTR Value2 l=600n w=3u
SYMATTR InstName M10
SYMBOL nmos4 848 -240 R0
WINDOW 123 56 100 Left 2
WINDOW 0 60 27 Left 2
SYMATTR Value2 l=600n w=3u
SYMATTR InstName M11
SYMBOL nmos4 1152 96 R0
WINDOW 123 56 100 Left 2
WINDOW 0 60 27 Left 2
SYMATTR Value2 l=600n w=3u
SYMATTR InstName M12
SYMBOL nmos4 1248 240 M0
WINDOW 123 56 100 Left 2
WINDOW 0 60 27 Left 2
SYMATTR Value2 l=600n w=3u
SYMATTR InstName M13
SYMBOL nmos4 944 96 M0
WINDOW 123 56 100 Left 2
WINDOW 0 60 27 Left 2
SYMATTR Value2 l=600n w=3u
SYMATTR InstName M14
SYMBOL NAND_2 1728 -240 R0
SYMATTR InstName X1
SYMBOL NAND_2 1728 -16 R0
SYMATTR InstName X2
SYMBOL Inv_6u_3u 1968 -240 R0
SYMATTR InstName X3
SYMBOL Inv_6u_3u 1968 -16 R0
SYMATTR InstName X4
SYMBOL Inv_30u_15u 2208 -240 R0
SYMATTR InstName X5
SYMBOL Inv_30u_15u 2192 -16 R0
SYMATTR InstName X6

amp.asc, the sub-circuit schematic file:
Version 4
SHEET 1 880 680
WIRE 48 -112 48 -160
WIRE 416 -112 48 -112
WIRE 48 -80 48 -112
WIRE 416 -80 416 -112
WIRE 224 -64 96 -64
WIRE 368 -64 224 -64
WIRE 416 16 48 16
WIRE 48 48 48 16
WIRE 416 48 416 16
WIRE 0 64 -32 64
WIRE 496 64 464 64
WIRE 48 176 48 144
WIRE 48 176 -32 176
WIRE 128 176 48 176
WIRE 416 176 416 144
WIRE 496 176 416 176
WIRE 48 192 48 176
WIRE 416 192 416 176
WIRE 128 272 128 176
WIRE 128 272 96 272
WIRE 224 272 224 -64
WIRE 224 272 128 272
WIRE 368 272 224 272
WIRE 48 320 48 288
WIRE 416 320 416 288
WIRE 0 0 0 0
FLAG 416 320 0
FLAG 416 240 0
FLAG -32 64 Inp
IOPIN -32 64 In
FLAG 416 -32 vdd
FLAG 496 176 Outp
IOPIN 496 176 Out
FLAG 48 -160 vdd
IOPIN 48 -160 In
FLAG 48 -32 vdd
FLAG 48 320 0
FLAG 48 240 0
FLAG 48 96 vdd
FLAG 416 96 vdd
FLAG 496 64 Inm
IOPIN 496 64 In
FLAG -32 176 Outm
IOPIN -32 176 Out
SYMBOL nmos4 368 192 R0
WINDOW 123 56 100 Left 2
WINDOW 0 60 27 Left 2
SYMATTR Value2 l=600n w=30u
SYMATTR InstName M1
SYMBOL pmos4 368 16 M180
WINDOW 123 56 100 Left 2
WINDOW 0 59 24 Left 2
SYMATTR Value2 l=600n w=30u
SYMATTR InstName M2
SYMBOL pmos4 96 16 R180
WINDOW 123 56 100 Left 2
WINDOW 0 59 24 Left 2
SYMATTR Value2 l=600n w=30u
SYMATTR InstName M3
SYMBOL nmos4 96 192 M0
WINDOW 123 56 100 Left 2
WINDOW 0 60 27 Left 2
SYMATTR Value2 l=600n w=30u
SYMATTR InstName M4
SYMBOL pmos4 0 144 M180
WINDOW 123 56 100 Left 2
WINDOW 0 59 24 Left 2
SYMATTR Value2 l=600n w=300u
SYMATTR InstName M5
SYMBOL pmos4 464 144 R180
WINDOW 123 56 100 Left 2
WINDOW 0 59 24 Left 2
SYMATTR Value2 l=600n w=300u
SYMATTR InstName M6

The netlist it stands for:
* _Fig9_33_MSD.asc
C3 int pos 800fF
XX36 Q_5i p2_1 b4 VDD dflop
XX37 Q_6i p2_2 b5 VDD dflop
XX38 Q_7i p2_3 b6 VDD dflop
XX39 Q_8i p2_4 b7 VDD dflop
XX40 Q_1i p1_1 b0 VDD dflop
XX41 Q_2i p1_2 b1 VDD dflop
XX42 Q_3i p1_3 b2 VDD dflop
XX43 Q_4i p1_4 b3 VDD dflop
XX25 VDD p2_4 p1_4 VCM Vin int Q_8 p2i_4 p1i_4 sc_input
XX26 VDD p2_3 p1_3 VCM Vin int Q_7 p2i_3 p1i_3 sc_input
XX27 VDD p2_2 p1_2 VCM Vin int Q_6 p2i_2 p1i_2 sc_input
XX29 VDD p2_1 p1_1 VCM Vin int Q_5 p2i_1 p1i_1 sc_input
XX30 VDD p1_4 p2_4 VCM Vin int Q_4 p1i_4 p2i_4 sc_input
XX31 VDD p1_3 p2_3 VCM Vin int Q_3 p1i_3 p2i_3 sc_input
XX32 VDD p1_2 p2_2 VCM Vin int Q_2 p1i_2 p2i_2 sc_input
XX33 VDD p1_1 p2_1 VCM Vin int Q_1 p1i_1 p2i_1 sc_input
XX44 p1_1 p2_1 p1_2 p2_2 p1_3 p2_3 p1_4 p2_4 p1i_1 p2i_1 p1i_2 p2i_2 p1i_3 p2i_3 p1i_4 p2i_4 VDD clock_gen
XX17 pos min Q_1 Q_1i VDD p1_1 clk_comparator
XX18 pos min Q_2 Q_2i VDD p1_2 clk_comparator
XX19 pos min Q_3 Q_3i VDD p1_3 clk_comparator
XX20 pos min Q_4 Q_4i VDD p1_4 clk_comparator
XX21 pos min Q_5 Q_5i VDD p2_1 clk_comparator
XX22 pos min Q_6 Q_6i VDD p2_2 clk_comparator
XX23 pos min Q_7 Q_7i VDD p2_3 clk_comparator
XX24 pos min Q_8 Q_8i VDD p2_4 clk_comparator
XX34 VCM int pos min VDD amp
R1 sum_d b0 100MEG
R2 sum_d b1 100MEG
R3 sum_d b2 100MEG
R4 sum_d b3 100MEG
R5 sum_d b4 100MEG
R6 sum_d b5 100MEG
R7 sum_d b6 100MEG
R8 sum_d b7 100MEG
C1 sum_d 0 0.025fF
R9 sum Q_1 100MEG
R10 sum Q_2 100MEG
R11 sum Q_3 100MEG
R12 sum Q_4 100MEG
R13 sum Q_5 100MEG
R14 sum Q_6 100MEG
R15 sum Q_7 100MEG
R16 sum Q_8 100MEG

* block symbol definitions
.subckt dflop D Clk Qi VDD
M2 N005 D 0 0 NMOS l=600n w=3u
M3 N004 D vdd vdd PMOS l=600n w=3u
M1 N005 Clk N004 vdd PMOS l=600n w=3u
M4 N006 Clk 0 0 NMOS l=600n w=3u
M5 N001 Clk vdd vdd PMOS l=600n w=3u
M6 N001 N005 N006 0 NMOS l=600n w=3u
M7 N007 N001 0 0 NMOS l=600n w=3u
M8 N002 N001 vdd vdd PMOS l=600n w=3u
M9 N002 Clk N007 0 NMOS l=600n w=3u
M10 N003 N002 0 0 NMOS l=600n w=3u
M11 N003 N002 vdd vdd PMOS l=600n w=3u
M12 Qi N003 0 0 NMOS l=600n w=3u
M13 Qi N003 vdd vdd PMOS l=600n w=3u
.ends dflop

.subckt sc_input VDD p1 p2 lt lb rt rb p1i p2i
M2 N001 p1 lt 0 NMOS l=600n w=15u
M3 lt p1i N001 vdd PMOS l=600n w=30u
M1 N002 p1 lb 0 NMOS l=600n w=15u
M4 lb p1i N002 vdd PMOS l=600n w=30u
M5 N001 p2 rt 0 NMOS l=600n w=15u
M6 rt p2i N001 vdd PMOS l=600n w=30u
M7 N002 p2 rb 0 NMOS l=600n w=15u
M8 rb p2i N002 vdd PMOS l=600n w=30u
C1 N001 N002 100f
.ends sc_input

.subckt clock_gen p1_1 p2_1 p1_2 p2_2 p1_3 p2_3 p1_4 p2_4 p1i_1 p2i_1 p1i_2 p2i_2 p1i_3 p2i_3 p1i_4 p2i_4 vdd
XX1 p1i_3 p2i_3 p1_1 p1i_1 p2i_1 p2_1 vdd delay
XX2 p1_1 p2_1 p1_2 p1i_2 p2i_2 p2_2 vdd delay
XX3 p1_2 p2_2 p1_3 p1i_3 p2i_3 p2_3 vdd delay
XX4 p1_3 p2_3 p1_4 p1i_4 p2i_4 p2_4 vdd delay
.ends clock_gen

.subckt delay intop inbot phi1 phi1i phi2i phi2 vdd
XX1 intop N004 N001 vdd nand_2
XX2 N003 inbot N005 vdd nand_2
XX3 N001 N002 vdd inv_6u_3u
XX4 N005 N006 vdd inv_6u_3u
XX5 N002 N003 vdd inv_6u_3u
XX6 N006 N004 vdd inv_6u_3u
XX7 N003 phi1 vdd inv_30u_15u
XX8 N004 phi2 vdd inv_30u_15u
XX9 phi1 phi1i vdd inv_30u_15u
XX10 phi2 phi2i vdd inv_30u_15u
.ends delay

.subckt nand_2 A B ANANDB vdd
M1 N001 B 0 0 NMOS l=600n w=3u
M2 ANANDB A N001 0 NMOS l=600n w=3u
M3 ANANDB B vdd vdd PMOS l=600n w=3u
M4 ANANDB A vdd vdd PMOS l=600n w=3u
.ends nand_2

.subckt inv_6u_3u In Out vdd
M2 Out In 0 0 NMOS l=600n w=3u
M3 Out In vdd vdd PMOS l=600n w=6u
.ends inv_6u_3u

.subckt inv_30u_15u In Out vdd
M2 Out In 0 0 NMOS l=600n w=15u
M3 Out In vdd vdd PMOS l=600n w=30u
.ends inv_30u_15u

.subckt clk_comparator InP InM Q Qbar vdd Clk
M1 N006 CLK 0 0 NMOS l=600n w=3u
M2 N006 CLK vdd vdd PMOS l=600n w=3u
M3 N001 N006 0 0 NMOS l=600n w=3u
M4 N001 N006 vdd vdd PMOS l=600n w=3u
M5 N003 N001 vdd vdd PMOS l=600n w=3u
M6 N002 N003 vdd vdd PMOS l=600n w=3u
M7 N002 N001 vdd vdd PMOS l=600n w=3u
M8 N003 N002 vdd vdd PMOS l=600n w=3u
M9 N011 InP 0 0 NMOS l=600n w=3u
M10 N002 N001 N010 0 NMOS l=600n w=3u
M11 N003 N001 N009 0 NMOS l=600n w=3u
M12 N010 N003 N012 0 NMOS l=600n w=3u
M13 N012 Inm 0 0 NMOS l=600n w=3u
M14 N009 N002 N011 0 NMOS l=600n w=3u
XX1 N002 N007 N004 vdd nand_2
XX2 N004 N003 N007 vdd nand_2
XX3 N004 N005 vdd inv_6u_3u
XX4 N007 N008 vdd inv_6u_3u
XX5 N005 Qbar vdd inv_30u_15u
XX6 N008 Q vdd inv_30u_15u
.ends clk_comparator

.subckt amp Inp Inm Outp Outm vdd
M1 Outp Outm 0 0 NMOS l=600n w=30u
M2 N001 Outm vdd vdd PMOS l=600n w=30u
M3 N001 Outm vdd vdd PMOS l=600n w=30u
M4 Outm Outm 0 0 NMOS l=600n w=30u
M5 Outm Inp N001 vdd PMOS l=600n w=300u
M6 Outp Inm N001 vdd PMOS l=600n w=300u
.ends amp

.model NMOS NMOS
.model PMOS PMOS
.lib standard.mos
VDD VDD 0 DC 5
VCM VCM 0 DC 2.5
Vin Vin 0 DC 0 SINE(2.5 2 10MEG)
.save V(vin) V(sum_d)
.include C5_models.txt
.options plotwinsize=0
.ic v(p1_1)=5 v(p2_1)=0
.tran 0.1n 300n UIC
.backanno
.end